# EAGLE design ClassicMouse Mark1 rev1 (EAGLE 9.6.2)
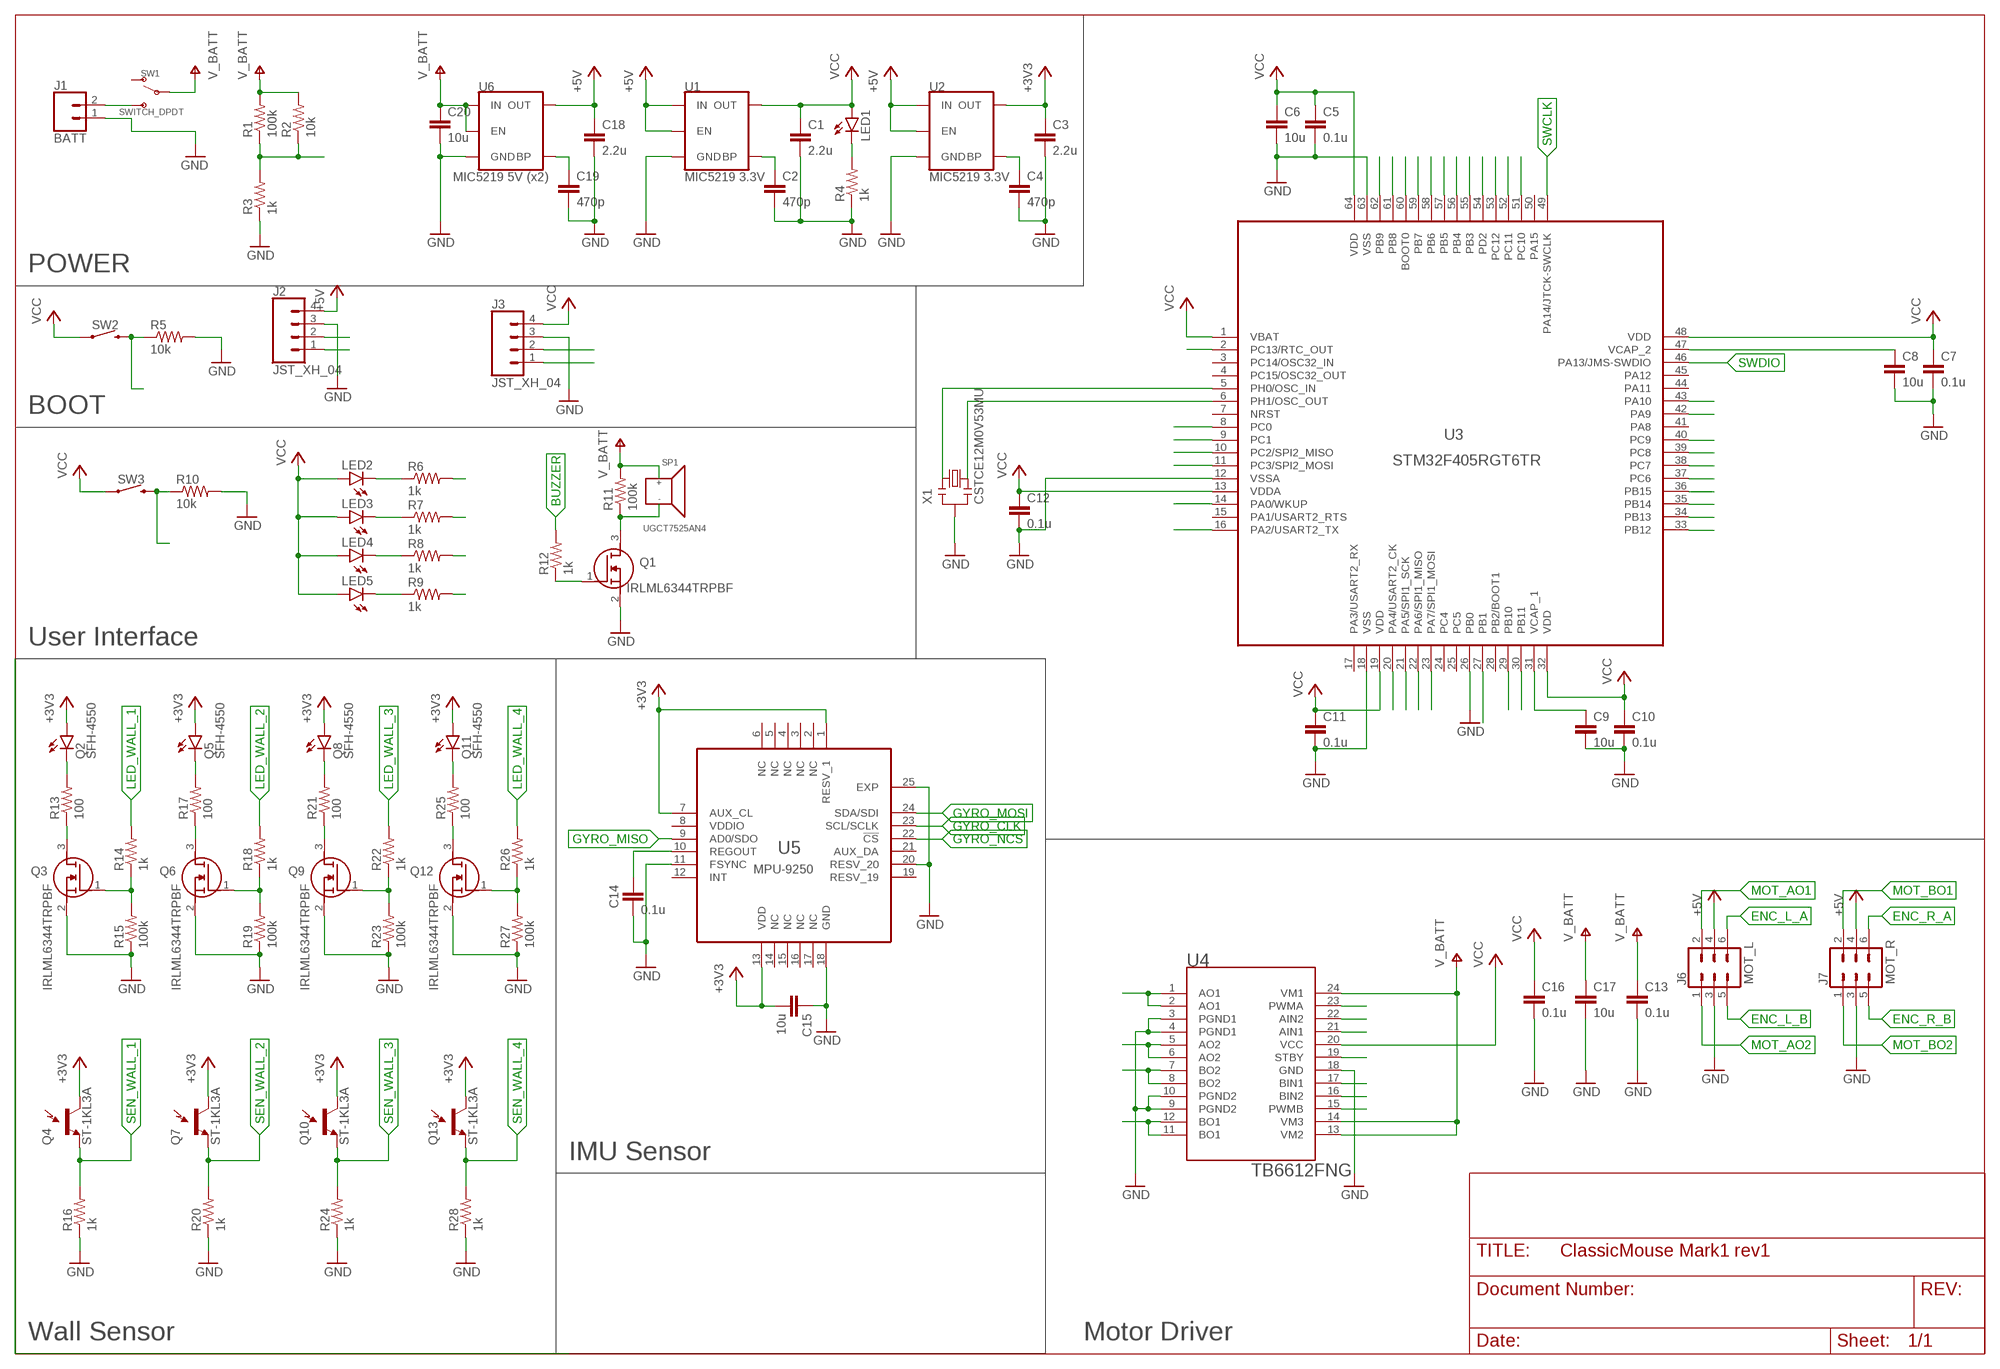
[diagram p0: schematic, sheet 1]

## Parts
C1  2.2u  C-EUC0603K  [C0603K]
C2  470p  C-EUC0603K  [C0603K]
C3  2.2u  C-EUC0603K  [C0603K]
C4  470p  C-EUC0603K  [C0603K]
C5  0.1u  C-EUC0603K  [C0603K]
C6  10u  C-EUC0603K  [C0603K]
C7  0.1u  C-EUC0603K  [C0603K]
C8  10u  C-EUC0603K  [C0603K]
C9  10u  C-EUC0603K  [C0603K]
C10  0.1u  C-EUC0603K  [C0603K]
C11  0.1u  C-EUC0603K  [C0603K]
C12  0.1u  C-EUC0603K  [C0603K]
C13  0.1u  C-EUC0603K  [C0603K]
C14  0.1u  C-EUC0603K  [C0603K]
C15  10u  C-EUC1206  [C1206]
C16  0.1u  C-EUC0603K  [C0603K]
C17  10u  C-EUC1206  [C1206]
C18  2.2u  C-EUC0603K  [C0603K]
C19  470p  C-EUC0603K  [C0603K]
C20  10u  C-EUC1206  [C1206]
J1  BATT  JST_XH_02  [JST-XH-02-PACKAGE-ROUND-PAD]
J2  JST_XH_04  [JST-XH-04-PACKAGE-ROUND-PAD]
J3  JST_XH_04  [JST-XH-04-PACKAGE-ROUND-PAD]
J6  MOT_L  2X3_PIN  [2X3-NS]
J7  MOT_R  2X3_PIN  [2X3-NS]
LED1  LEDCHIPLED_0603  [CHIPLED_0603]
LED2  LEDCHIPLED_0603  [CHIPLED_0603]
LED3  LEDCHIPLED_0603  [CHIPLED_0603]
LED4  LEDCHIPLED_0603  [CHIPLED_0603]
LED5  LEDCHIPLED_0603  [CHIPLED_0603]
Q1  IRLML6344TRPBF  [SOT95P260X110-3N]
Q2  SFH-4550  YZ000  [CONN_02]
Q3  IRLML6344TRPBF  [SOT95P260X110-3N]
Q4  ST-1KL3A  [CONN_02]
Q5  SFH-4550  YZ000  [CONN_02]
Q6  IRLML6344TRPBF  [SOT95P260X110-3N]
Q7  ST-1KL3A  [CONN_02]
Q8  SFH-4550  YZ000  [CONN_02]
Q9  IRLML6344TRPBF  [SOT95P260X110-3N]
Q10  ST-1KL3A  [CONN_02]
Q11  SFH-4550  YZ000  [CONN_02]
Q12  IRLML6344TRPBF  [SOT95P260X110-3N]
Q13  ST-1KL3A  [CONN_02]
R1  100k  R-US_R0603  [R0603]
R2  10k  R-US_R0603  [R0603]
R3  1k  R-US_R0603  [R0603]
R4  1k  R-US_R0603  [R0603]
R5  10k  R-US_R0603  [R0603]
R6  1k  R-US_R0603  [R0603]
R7  1k  R-US_R0603  [R0603]
R8  1k  R-US_R0603  [R0603]
R9  1k  R-US_R0603  [R0603]
R10  10k  R-US_R0603  [R0603]
R11  100k  R-US_R0603  [R0603]
R12  1k  R-US_R0603  [R0603]
R13  100  R-US_R0603  [R0603]
R14  1k  R-US_R0603  [R0603]
R15  100k  R-US_R0603  [R0603]
R16  1k  R-US_R0603  [R0603]
R17  100  R-US_R0603  [R0603]
R18  1k  R-US_R0603  [R0603]
R19  100k  R-US_R0603  [R0603]
R20  1k  R-US_R0603  [R0603]
R21  100  R-US_R0603  [R0603]
R22  1k  R-US_R0603  [R0603]
R23  100k  R-US_R0603  [R0603]
R24  1k  R-US_R0603  [R0603]
R25  100  R-US_R0603  [R0603]
R26  1k  R-US_R0603  [R0603]
R27  100k  R-US_R0603  [R0603]
R28  1k  R-US_R0603  [R0603]
SP1  UGCT7525AN4  [UGCT7525AN4]
SW1  SWITCH_DPDT  [SWITCH_DPDT]
SW2  MOMENTARY-SWITCH-SPST-SMD-4.6X2.8MM  [TACTILE_SWITCH_SMD_4.6X2.8MM]
SW3  MOMENTARY-SWITCH-SPST-SMD-4.6X2.8MM  [TACTILE_SWITCH_SMD_4.6X2.8MM]
U1  MIC5219 3.3V  V_REG_MIC52193.3V  [SOT23-5]
U2  MIC5219 3.3V  V_REG_MIC52193.3V  [SOT23-5]
U3  STM32F405RGT6TR  [QFP50P1200X1200X160-64N]
U4  TB6612FNG  [SOP65P760X160-24N]
U5  MPU-9250  [QFN40P300X300X105-25N]
U6  MIC5219 5V (x2)  V_REG_MIC52193.3V  [SOT23-5]
X1  CSTCE12M0V53MU  [CSTCE12M0V53]

## Nets
+3V3: C3.1 C15.2 Q2.+(A) Q4.+(C1) Q5.+(A) Q7.+(C1) Q8.+(A) Q10.+(C1) Q11.+(A) Q13.+(C1) U2.5(OUT) U5.1(RESV_1) U5.7(AUX_CL) U5.13(VDD)
+5V: C18.1 J2.4 J6.4 J7.4 U1.1(IN) U1.3(EN) U2.1(IN) U2.3(EN) U6.5(OUT)
BATT_V: R1.1 R2.1 R3.2 U3.27(PB1)
BOOT0/SWITCH1: R5.1 SW2.3 SW2.4 U3.2(PC13/RTC_OUT) U3.60(BOOT0)
BUZZER: R12.2 U3.62(PB9)
ENC_L_A: J6.6 U3.56(PB4)
ENC_L_B: J6.5 U3.57(PB5)
ENC_R_A: J7.6 U3.58(PB6)
ENC_R_B: J7.5 U3.59(PB7)
GND: C1.2 C2.2 C3.2 C4.2 C5.2 C6.2 C7.2 C8.2 C9.2 C10.2 C11.2 C12.2 C13.2 C14.2 C15.1 C16.2 C17.2 C18.2 C19.2 C20.2 J1.1 J2.3 J3.3 J6.3 J7.3 Q1.2(S) Q3.2(S) Q6.2(S) Q9.2(S) Q12.2(S) R3.1 R4.1 R5.2 R10.2 R15.1 R16.1 R19.1 R20.1 R23.1 R24.1 R27.1 R28.1 U1.2(GND) U2.2(GND) U3.12(VSSA) U3.18(VSS) U3.26(PB0) U3.63(VSS) U4.3(PGND1) U4.4(PGND1) U4.9(PGND2) U4.10(PGND2) U4.18(GND) U5.11(FSYNC) U5.18(GND) U5.20(RESV_20) U5.25(EXP) U6.2(GND) X1.2
GYRO_CLK: U3.21(PA5/SPI1_SCK) U5.23(SCL/SCLK)
GYRO_MISO: U3.22(PA6/SPI1_MISO) U5.9(AD0/SDO)
GYRO_MOSI: U3.23(PA7/SPI1_MOSI) U5.24(SDA/SDI)
GYRO_NCS: U3.20(PA4/USART2_CK) U5.22(!CS)
LCD_SCL: U3.29(PB10)
LCD_SDA: U3.30(PB11)
LED1: R6.2 U3.40(PC9)
LED2: R7.2 U3.39(PC8)
LED3: R8.2 U3.38(PC7)
LED4: R9.2 U3.37(PC6)
LED_WALL_1: R14.2 U3.36(PB15)
LED_WALL_2: R18.2 U3.35(PB14)
LED_WALL_3: R22.2 U3.34(PB13)
LED_WALL_4: R26.2 U3.33(PB12)
MD_AIN1: U3.52(PC11) U4.21(AIN1)
MD_AIN2: U3.51(PC10) U4.22(AIN2)
MD_BIN1: U3.54(PD2) U4.17(BIN1)
MD_BIN2: U3.55(PB3) U4.16(BIN2)
MD_PWMA: U3.14(PA0/WKUP) U4.23(PWMA)
MD_PWMB: U3.16(PA2/USART2_TX) U4.15(PWMB)
MD_STBY: U3.53(PC12) U4.19(STBY)
MOT_AO1: J6.2 U4.1(AO1) U4.2(AO1)
MOT_AO2: J6.1 U4.5(AO2) U4.6(AO2)
MOT_BO1: J7.2 U4.11(BO1) U4.12(BO1)
MOT_BO2: J7.1 U4.7(BO2) U4.8(BO2)
N$1: J1.2 SW1.3(S) SW1.6(S)
N$2: C2.1 U1.4(BP)
N$3: U3.6(PH1/OSC_OUT) X1.3
N$4: C4.1 U2.4(BP)
N$5: U3.5(PH0/OSC_IN) X1.1
N$6: C8.1 U3.47(VCAP_2)
N$7: C9.1 U3.31(VCAP_1)
N$8: LED1.C R4.2
N$9: Q1.3(D) R11.1 SP1.2(GND)
N$10: Q1.1(G) R12.1
N$11: Q2.-(C) R13.2
N$12: Q3.3(D) R13.1
N$13: Q5.-(C) R17.2
N$14: Q3.1(G) R14.1 R15.2
N$15: Q6.3(D) R17.1
N$16: Q6.1(G) R18.1 R19.2
N$17: Q8.-(C) R21.2
N$18: Q9.3(D) R21.1
N$19: Q9.1(G) R22.1 R23.2
N$20: Q11.-(C) R25.2
N$21: Q12.3(D) R25.1
N$22: Q12.1(G) R26.1 R27.2
N$24: LED2.C R6.1
N$25: LED3.C R7.1
N$26: C14.1 U5.10(REGOUT)
N$27: C19.1 U6.4(BP)
N$28: LED4.C R8.1
N$29: LED5.C R9.1
SEN_WALL_1: Q4.-(E1) R16.2 U3.8(PC0)
SEN_WALL_2: Q7.-(E1) R20.2 U3.9(PC1)
SEN_WALL_3: Q10.-(E1) R24.2 U3.10(PC2/SPI2_MISO)
SEN_WALL_4: Q13.-(E1) R28.2 U3.11(PC3/SPI2_MOSI)
SWCLK: J3.1 U3.49(PA14/JTCK-SWCLK)
SWDIO: J3.2 U3.46(PA13/JMS-SWDIO)
SWITCH2: R10.1 SW3.3 SW3.4 U3.61(PB8)
USART_RX: J2.1 U3.43(PA10)
USART_TX: J2.2 U3.42(PA9)
V+: C13.1 C17.1 C20.1 R1.2 R2.2 R11.2 SP1.1(V) SW1.2(P) SW1.5(P) U4.13(VM2) U4.14(VM3) U4.24(VM1) U6.1(IN) U6.3(EN) ; supply symbol labelled V_BATT
VCC: C1.1 C5.1 C6.1 C7.1 C10.1 C11.1 C12.1 C16.1 J3.4 LED1.A LED2.A LED3.A LED4.A LED5.A SW2.1 SW2.2 SW3.1 SW3.2 U1.5(OUT) U3.1(VBAT) U3.13(VDDA) U3.19(VDD) U3.32(VDD) U3.48(VDD) U3.64(VDD) U4.20(VCC)
Unconnected: SW1.1(O) SW1.4(O) U3.3(PC14/OSC32_IN) U3.4(PC15/OSC32_OUT) U3.7(NRST) U3.15(PA1/USART2_RTS) U3.17(PA3/USART2_RX) U3.24(PC4) U3.25(PC5) U3.28(PB2/BOOT1) U3.41(PA8) U3.44(PA11) U3.45(PA12) U3.50(PA15) U5.2(NC) U5.3(NC) U5.4(NC) U5.5(NC) U5.6(NC) U5.12(INT) U5.14(NC) U5.15(NC) U5.16(NC) U5.17(NC) U5.19(RESV_19) U5.21(AUX_DA)

## Notes on the sheet
- POWER
- BOOT
- User Interface
- IMU Sensor
- Wall Sensor | Motor Driver

## Power pins joined to a net without a drawn wire
VDDIO: U5.8(VDDIO)

## Library data of the parts
C1-C20 = rcl:C-EU: CAPACITOR, European symbol; SPICEPREFIX: C
J1 = MM_CONN:JST_XH_02
J2 J3 = MM_CONN:JST_XH_04
J6 J7 = MM_CONN:2X3_PIN
LED1-LED5 = led:LED: LED OSRAM: - CHIPLED LG R971, LG N971, LY N971, LG Q971, LY Q971, LO R971, LY R971 LH N974, LH R974 LS Q976, LO Q976, LY Q976 LO Q996 - Hyper CHIPLED LW Q18S LB Q993, LB Q99A, LB R99A - SideLED LS A670, LO A670, LY A670, LG A670, LP A670 LB A673, LV A673, LT A673, LW A673 LH A674 LY A675 LS A676, LA A676, LO A676, LY A676, LW A676 LS A679, LY A679, LG A679 - Hyper Micro SIDELED® LS Y876, LA Y876, LO Y876, LY Y876 LT Y87S - SmartLED LW L88C, LW L88S LB L89C, LB L89S, LG L890 LS L89K, LO L89K, LY L89K LS L896, LA L896, LO L896, LY L896 - TOPLED LS T670, LO T670, LY T670, LG T670, LP T670 LSG T670, LSP T670, LSY T670, LOP T670, LYG T670 LG T671, LOG T671, LSG T671 LB T673, LV T673, LT T673, LW T673 LH T674 LS T676, LA T676, LO T676, LY T676, LB T676, LH T676, LSB T676, LW T676 LB T67C, LV T67C, LT T67C, LS T67K, LO T67K, LY T67K, LW E67C LS E67B, LA E67B, LO E67B, LY E67B, LB E67C, LV E67C, LT E67C LW T67C LS T679, LY T679, LG T679 LS T770, LO T770, LY T770, LG T770, LP T770 LB T773, LV T773, LT T773, LW T773 LH T774 LS E675, LA E675, LY E675, LS T675 LS T776, LA T776, LO T776, LY T776, LB T776 LHGB T686 LT T68C, LB T68C - Hyper Mini TOPLED® LB M676 - Mini TOPLED Santana® LG M470 LS M47K, LO M47K, LY M47K Source: http://www.osram.convergy.de LUXEON: - LUMILED® LXK2-PW12-R00, LXK2-PW12-S00, LXK2-PW14-U00, LXK2-PW14-V00 LXK2-PM12-R00, LXK2-PM12-S00, LXK2-PM14-U00 LXK2-PE12-Q00, LXK2-PE12-R00, LXK2-PE12-S00, LXK2-PE14-T00, LXK2-PE14-U00 LXK2-PB12-K00, LXK2-PB12-L00, LXK2-PB12-M00, LXK2-PB14-N00, LXK2-PB14-P00, LXK2-PB14-Q00 LXK2-PR12-L00, LXK2-PR12-M00, LXK2-PR14-Q00, LXK2-PR14-R00 LXK2-PD12-Q00, LXK2-PD12-R00, LXK2-PD12-S00 LXK2-PH12-R00, LXK2-PH12-S00 LXK2-PL12-P00, LXK2-PL12-Q00, LXK2-PL12-R00 Source: www.luxeon.com KINGBRIGHT: KA-3528ASYC Source: www.kingbright.com
Q1 Q3 Q6 Q9 Q12 = IRLML6344TRPBF:IRLML6344TRPBF: International Rectifier IRLML6344TRPBF N-channel MOSFET Transistor, 5 A, 30 V, 3-Pin SOT-23 Source: Datasheet <http://docs-emea.rs-online.com/webdocs/0f87/0900766b80f8731b.pdf>; DESCRIPTION: International Rectifier IRLML6344TRPBF N-channel MOSFET Transistor, 5 A, 30 V, 3-Pin SOT-23; HEIGHT: 1.1mm; MANUFACTURER_NAME: Infineon; MANUFACTURER_PART_NUMBER: IRLML6344TRPBF; MOUSER_PART_NUMBER: 942-IRLML6344TRPBF; MOUSER_PRICE-STOCK: https://www.mouser.com/Search/Refine.aspx?Keyword=942-IRLML6344TRPBF; RS_PART_NUMBER: 9134073; RS_PRICE-STOCK: http://uk.rs-online.com/web/p/products/9134073
Q2 Q5 Q8 Q11 = MM_SENSOR:YZ000
Q4 Q7 Q10 Q13 = MM_SENSOR:ST-1KL3A
R1-R28 = rcl:R-US_: RESISTOR, American symbol; SPICEPREFIX: R
SP1 = UGCT7525AN4:UGCT7525AN4
SW1 = MM_SWITCH:SWITCH_DPDT
SW2 SW3 = MM_SWITCH:MOMENTARY-SWITCH-SPST: Momentary Switch (Pushbutton) - SPST Normally-open (NO) SPST momentary switches (buttons, pushbuttons). Variants PTH-12MM - 12mm square, through-hole Momentary Pushbutton Switch - 12mm Square <https://www.sparkfun.com/products/9190> (COM-09190) PTH-6.0MM, PTH-6.0MM-KIT - 6.0mm square, through-hole Mini Pushbutton Switch <https://www.sparkfun.com/products/97> (COM-00097) KIT package intended for soldering kit's - only one side of pads' copper is exposed. PTH-RIGHT-ANGLE-KIT - Right-angle, through-hole Right Angle Tactile Button <https://www.sparkfun.com/products/10791> - Used on SparkFun BigTime Watch Kit <https://www.sparkfun.com/products/11734> SMD-12MM - 12mm square, surface-mount Tactile Button - SMD (12mm) <https://www.sparkfun.com/products/12993> (COM-12993) Used on SparkFun PicoBoard <https://www.sparkfun.com/products/11888> SMD-4.5MM - 4.5mm Square Trackball Switch Used on SparkFun Blackberry Trackballer Breakout <https://www.sparkfun.com/products/13169> SMD-4.6MMX2.8MM - 4.60mm x 2.80mm, surface mount Used on SparkFun Pro Micro - RP2040 <https://www.sparkfun.com/products/17717> SMD-5.2MM, SMD-5.2-REDUNDANT - 5.2mm square, surface-mount Mini Pushbutton Switch - SMD <https://www.sparkfun.com/products/8720> (COM-08720) Used on Arduino Pro Mini <https://www.sparkfun.com/products/11114> REDUNDANT package connects both switch circuits together SMD-6.0X3.5MM - 6.0 x 3.5mm, surface mount Momentary Reset Switch SMD <https://www.sparkfun.com/products/8229> (COM-08229) SMD-6.2MM-TALL - 6.2mm square, surface mount Tactile Button - SMD (6mm) <https://www.sparkfun.com/products/12992> Used on SparkFun Digital Sandbox <https://www.sparkfun.com/products/12651> SMD-RIGHT-ANGLE - Right-angle, surface mount Used on SparkFun Block for Intel® Edison - Arduino <https://www.sparkfun.com/products/13036>; PROD_ID: SWCH-15606
U1 U2 = MM_POWER:V_REG_MIC5219: V_REG MIC5219 Standard 3.3V and 5V 500mA LDO voltage regulator in SOT-23 layout. Micrel part MIC5219. BP (by-pass) pin is used to lower output noise with 470pF cap, may be left open.; PROD_ID: VREG-09872
U3 = STM32F405RGT6TR:STM32F405RGT6TR: High-performance foundation line, ARM Cortex-M4 core with DSP and FPU, 1 Mbyte Flash, 168 MHz CPU, ART Accelerator Check availability <https://pricing.snapeda.com/parts/STM32F405RGT6TR/STMicroelectronics/view-part?ref=eda>; AVAILABILITY: In Stock; DESCRIPTION: ARM® Cortex®-M4 STM32F4 Microcontroller IC 32-Bit Single-Core 168MHz 1MB (1M x 8) FLASH 64-LQFP (10x10); MF: STMicroelectronics; MP: STM32F405RGT6TR; PACKAGE: LQFP-64 STMicroelectronics; PRICE: None; PURCHASE-URL: https://pricing.snapeda.com/search/part/STM32F405RGT6TR/?ref=eda
U4 = TB6612FNG:TB6612FNG: Stepping Motor Driver Ic Unipolor Copper Wire 8"; AVAILABILITY: Unavailable; DESCRIPTION: Stepping Motor Driver Ic Unipolor Copper Wire 8; MF: Toshiba; MP: TB6612FNG,C,8,EL; PACKAGE: SSOP-24 Toshiba; PRICE: None
U5 = MPU-9250:MPU-9250: Check availability <https://pricing.snapeda.com/parts/MPU-9250/TDK%20InvenSense/view-part?ref=eda>; AVAILABILITY: In Stock; DESCRIPTION: Accelerometer, Gyroscope, Magnetometer, 9 Axis Sensor I²C, SPI Output; MF: TDK InvenSense; MP: MPU-9250; PACKAGE: TFQFN-24 TDK InvenSense; PRICE: None; PURCHASE-URL: https://pricing.snapeda.com/search/part/MPU-9250/?ref=eda
U6 = MM_POWER:V_REG_MIC5219: V_REG MIC5219 Standard 3.3V and 5V 500mA LDO voltage regulator in SOT-23 layout. Micrel part MIC5219. BP (by-pass) pin is used to lower output noise with 470pF cap, may be left open.; PROD_ID: VREG-09872; VALUE: MIC5219 3.3V
X1 = CSTCE12M:CSTCE12M0V53: CSTCE16M0V53 Ceramic Resonator (CERALOCK) 16 MHz Chip Type; AVAILABILITY: Unavailable; DESCRIPTION: CERALOCK 16.000MHz +/-5% 15pF; MF: Murata; MP: CSTCE16M0V53; PACKAGE: None; PRICE: None

## Board
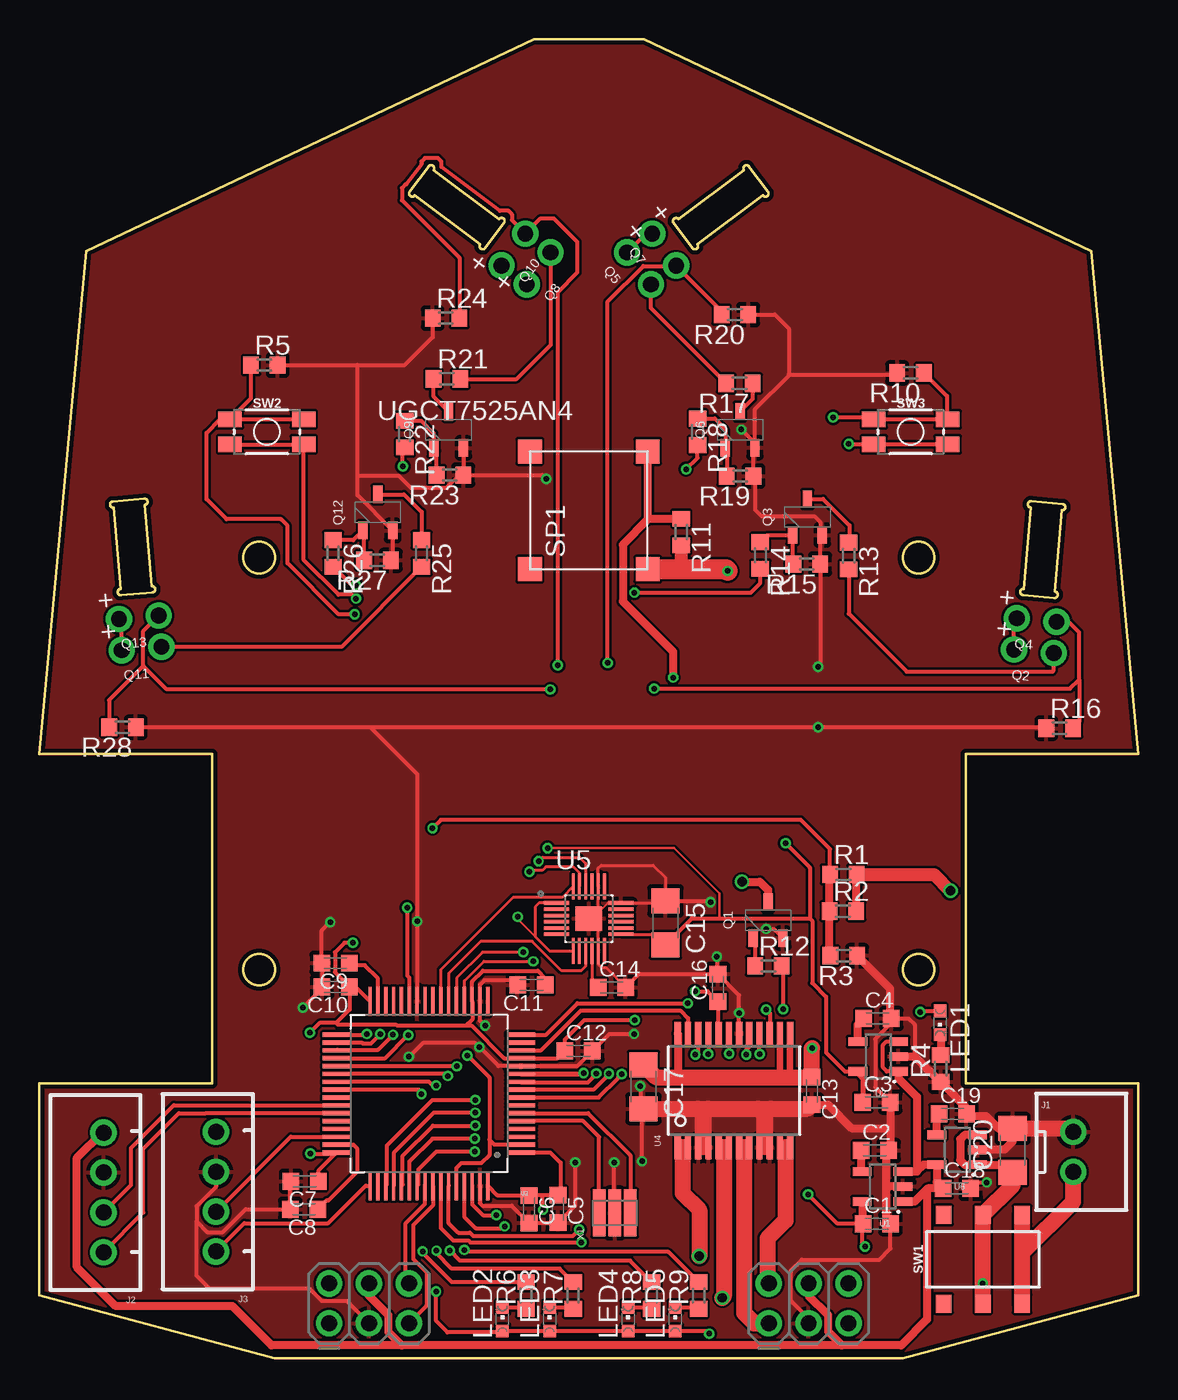
[diagram p1: board, top side]
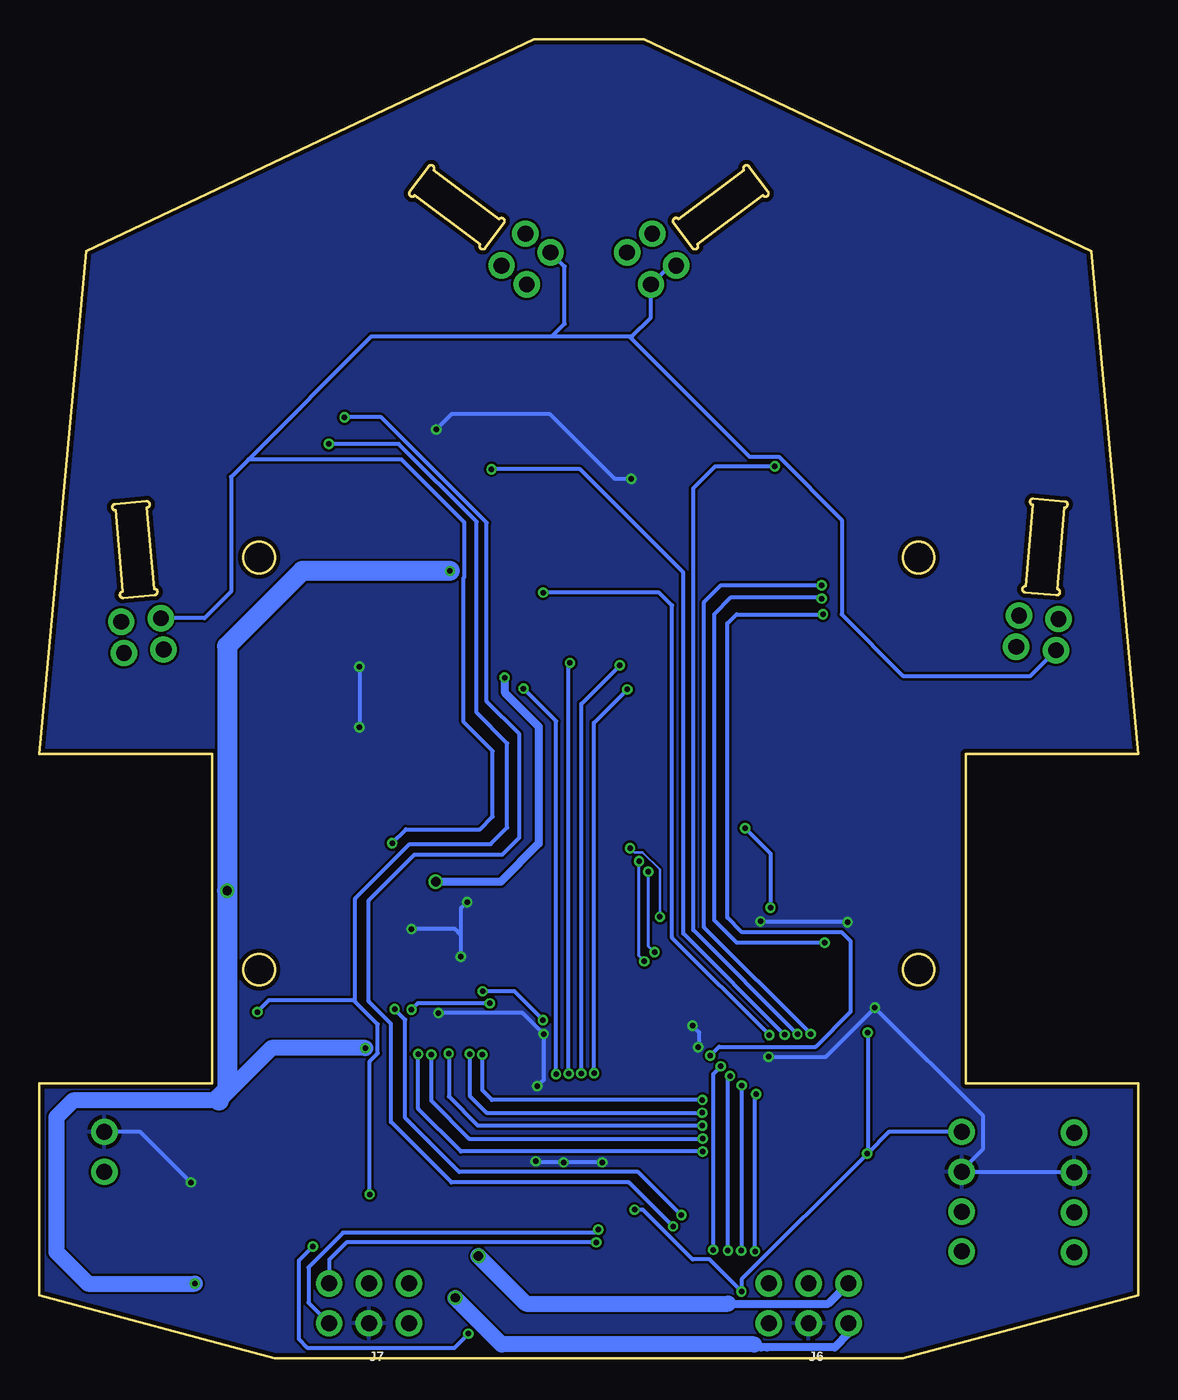
[diagram p2: board, bottom side, seen from below]

Size 70 x 84 mm. Coordinates in mm from the lower left corner, seen from the top.
Outline: 59,38.5 70,38.5 67,70.5 38.5,84 31.5,84 3,70.5 0,38.5 11,38.5 11,17.5 0,17.5 0,4 15,0 55,0 70,4 70,17.5 59,17.5 59,38.5
Outline: 62.66,48.6 64.65,48.43 arc180 64.68,48.83 65.14,54.01 arc180 65.17,54.41 63.18,54.58 arc180 63.14,54.18 62.69,49 arc180 62.66,48.6
Outline: 40.4,72.3 41.6,70.7 arc180 41.92,70.94 46.08,74.06 arc180 46.4,74.3 45.2,75.9 arc180 44.88,75.66 40.72,72.54 arc180 40.4,72.3
Outline: 28.4,70.7 29.6,72.31 arc180 29.28,72.55 25.12,75.66 arc180 24.8,75.9 23.6,74.3 arc180 23.92,74.06 28.08,70.94 arc180 28.4,70.7
Outline: 5.21,48.6 7.21,48.77 arc180 7.17,49.17 6.72,54.35 arc180 6.68,54.75 4.69,54.57 arc180 4.73,54.17 5.18,49 arc180 5.21,48.6
Outline: circle at 14,24.75 radius 1
Outline: circle at 56,24.75 radius 1
Outline: circle at 56,51 radius 1
Outline: circle at 14,51 radius 1
Copper layers (1*16): Top 0.035mm / dielectric 1.5mm / Bottom 0.035mm
Design rules "Elecrow_2-layer_eagle_rule": minimum track width 6mil, minimum drill 12mil, track to track 6mil, track to pad 6mil, pad to pad 6mil, via to via 6mil, smd to smd 0mil, copper to edge 10mil, drill to drill 10mil, minimum pad ring 10mil, minimum via ring 6mil, stop-mask expansion 2mil, vias tented up to drill 100mil, thermal gap 10mil

### Footprints (pad centres in the part's own frame; a part is rotated, then mirrored left to right if it is on the bottom)
C0603K = smd 1.05 x 1.08: 1 -0.875,0; 2 0.875,0
C1206 = smd 1.6 x 1.8: 1 -1.4,0; 2 1.4,0
JST-XH-02-PACKAGE-ROUND-PAD = drill 1.016 pad 1.676: 1 -1.27,0; 2 1.27,0
JST-XH-04-PACKAGE-ROUND-PAD = drill 1.016 pad 1.676: 1 -3.81,0; 2 -1.27,0; 3 1.27,0; 4 3.81,0
2X3-NS = drill 1.016 pad 1.676: 1 -2.54,1.27; 2 -2.54,-1.27; 3 0,1.27; 4 0,-1.27; 5 2.54,1.27; 6 2.54,-1.27
CHIPLED_0603 = smd 0.8 x 0.8: A 0,-0.75; C 0,0.75
SOT95P260X110-3N = smd 1.1 x 0.6: 1 -1.15,0.95; 2 -1.15,-0.95; 3 1.15,0
CONN_02 = drill 1 pad 1.676: + -1.27,0; - 1.27,0
R0603 = smd 1 x 1.1: 1 -0.85,0; 2 0.85,0
UGCT7525AN4 = smd 1.524 x 1.524: 1 -3.75,3.75; 2 -3.75,-3.75; 3 3.75,3.75; 4 3.75,-3.75
SWITCH_DPDT = smd 1 x 1.15: 1 -2.5,2.825; 2 0,2.825; 3 2.5,2.825; 4 -2.5,-2.825; 5 0,-2.825; 6 2.5,-2.825
TACTILE_SWITCH_SMD_4.6X2.8MM = smd 1.5 x 1: 1 -2.35,-0.8; 2 2.35,-0.8; 3 2.35,0.8; 4 -2.35,0.8
SOT23-5 = smd 0.55 x 1.2: 1 -0.95,-1.3; 2 0,-1.3; 3 0.95,-1.3; 4 0.95,1.3; 5 -0.95,1.3
QFP50P1200X1200X160-64N = smd 1.87 x 0.28: 1 -5.87,3.75; 2 -5.87,3.25; 3 -5.87,2.75; 4 -5.87,2.25; 5 -5.87,1.75; 6 -5.87,1.25; 7 -5.87,0.75; 8 -5.87,0.25; 9 -5.87,-0.25; 10 -5.87,-0.75; 11 -5.87,-1.25; 12 -5.87,-1.75; 13 -5.87,-2.25; 14 -5.87,-2.75; 15 -5.87,-3.25; 16 -5.87,-3.75; 33 5.87,-3.75; 34 5.87,-3.25; 35 5.87,-2.75; 36 5.87,-2.25; 37 5.87,-1.75; 38 5.87,-1.25; 39 5.87,-0.75; 40 5.87,-0.25; 41 5.87,0.25; 42 5.87,0.75; 43 5.87,1.25; 44 5.87,1.75; 45 5.87,2.25; 46 5.87,2.75; 47 5.87,3.25; 48 5.87,3.75 | smd 0.28 x 1.87: 17 -3.75,-5.87; 18 -3.25,-5.87; 19 -2.75,-5.87; 20 -2.25,-5.87; 21 -1.75,-5.87; 22 -1.25,-5.87; 23 -0.75,-5.87; 24 -0.25,-5.87; 25 0.25,-5.87; 26 0.75,-5.87; 27 1.25,-5.87; 28 1.75,-5.87; 29 2.25,-5.87; 30 2.75,-5.87; 31 3.25,-5.87; 32 3.75,-5.87; 49 3.75,5.87; 50 3.25,5.87; 51 2.75,5.87; 52 2.25,5.87; 53 1.75,5.87; 54 1.25,5.87; 55 0.75,5.87; 56 0.25,5.87; 57 -0.25,5.87; 58 -0.75,5.87; 59 -1.25,5.87; 60 -1.75,5.87; 61 -2.25,5.87; 62 -2.75,5.87; 63 -3.25,5.87; 64 -3.75,5.87
SOP65P760X160-24N = smd 1.5 x 0.4: 1 -3.625,3.575; 2 -3.625,2.925; 3 -3.625,2.275; 4 -3.625,1.625; 5 -3.625,0.975; 6 -3.625,0.325; 7 -3.625,-0.325; 8 -3.625,-0.975; 9 -3.625,-1.625; 10 -3.625,-2.275; 11 -3.625,-2.925; 12 -3.625,-3.575; 13 3.625,-3.575; 14 3.625,-2.925; 15 3.625,-2.275; 16 3.625,-1.625; 17 3.625,-0.975; 18 3.625,-0.325; 19 3.625,0.325; 20 3.625,0.975; 21 3.625,1.625; 22 3.625,2.275; 23 3.625,2.925; 24 3.625,3.575
QFN40P300X300X105-25N = smd 1.64 x 0.22: 1 -2.045,1; 2 -2.045,0.6; 3 -2.045,0.2; 4 -2.045,-0.2; 5 -2.045,-0.6; 6 -2.045,-1; 13 2.045,-1; 14 2.045,-0.6; 15 2.045,-0.2; 16 2.045,0.2; 17 2.045,0.6; 18 2.045,1 | smd 0.22 x 1.64: 7 -1,-2.045; 8 -0.6,-2.045; 9 -0.2,-2.045; 10 0.2,-2.045; 11 0.6,-2.045; 12 1,-2.045; 19 1,2.045; 20 0.6,2.045; 21 0.2,2.045; 22 -0.2,2.045; 23 -0.6,2.045; 24 -1,2.045 | smd 1.7 x 1.54: 25 0,0
CSTCE12M0V53 = smd 0.8 x 3: 1 0.45,1.688; 2 1.45,1.688; 3 2.45,1.688

### Placement (x,y rotation side)
C1  53.34,8.57 0 top
C2  53.22,13.24 0 top
C3  53.32,16.3 0 top
C4  53.39,21.65 0 top
C5  33.02,9.51 270 top
C6  31.18,9.5 270 top
C7  16.9,11.28 180 top
C8  16.86,9.5 180 top
C9  18.86,25.16 180 top
C10  18.87,23.66 180 top
C11  31.35,23.78 180 top
C12  34.35,19.57 0 top
C13  49.2,17.02 270 top
C14  36.46,23.63 0 top
C15  39.88,27.73 270 top
C16  43.21,23.6 90 top
C17  38.48,17.29 270 top
C18  58.44,10.82 0 top
C19  58.17,15.57 0 top
C20  61.99,13.24 90 top
J1  65.85,13.15 270 top
J2  4.09,10.56 90 top
J3  11.25,10.61 90 top
J6  21,3.5 180 bottom
J7  49,3.5 180 bottom
LED1  57.36,21.37 180 top
LED2  29.5,2.5 0 top
LED3  32.5,2.5 0 top
LED4  37.5,2.5 0 top
LED5  40.5,2.5 0 top
Q1  46.41,27.91 90 top
Q2  63.35,45.03 355 top
Q3  48.92,53.57 90 top
Q4  63.52,47.02 355 top
Q5  38.2,69.41 306.8 top
Q6  44.63,59.14 90 top
Q7  39.8,70.61 306.8 top
Q8  31.8,69.41 53.2 top
Q9  26.07,59.13 90 top
Q10  30.2,70.61 53.2 top
Q11  6.52,45.2 5 top
Q12  21.56,53.87 90 top
Q13  6.34,47.19 5 top
R1  51.21,30.81 0 top
R2  51.18,28.47 0 top
R3  51.24,25.64 180 top
R4  57.41,18.45 90 top
R5  14.34,63.25 0 top
R6  31,4 90 top
R7  34,4 90 top
R8  39,4 90 top
R9  42,4 90 top
R10  55.49,62.75 180 top
R11  40.88,52.62 270 top
R12  46.44,24.99 0 top
R13  51.55,51.1 270 top
R14  45.92,51.13 270 top
R15  48.89,50.58 180 top
R16  64.99,40.12 0 top
R17  44.59,62.09 180 top
R18  41.93,59 270 top
R19  44.63,56.18 180 top
R20  44.3,66.47 180 top
R21  25.97,62.37 0 top
R22  23.28,58.85 270 top
R23  26.16,56.25 180 top
R24  25.91,66.24 0 top
R25  24.35,51.26 270 top
R26  18.72,51.26 270 top
R27  21.54,50.82 180 top
R28  5.3,40.19 180 top
SP1  35,54 180 top
SW1  60.09,6.3 0 top
SW2  14.5,59 0 top
SW3  55.5,59 0 top
U1  53.71,10.94 90 top
U2  53.43,19.22 90 top
U3  24.82,16.86 180 top
U4  44.24,17.06 90 top
U5  35,28 0 top
U6  58.46,13.28 90 top
X1  35.2,7.57 0 top

### Tracks (layer width: path | path; a pad name or v marks a point on that pad's centre or on a via)
+3V3  (via drill 0.35)
  Top 0.152: 31.58,26.86 30.47,27.97 v30.47,28.11 | v32.37,32.49 40.42,32.49 43.31,29.61 43.31,28.02
  Top 0.2: U5.1 31.84,29 31.58,28.74 31.58,26.86 32.49,25.95 U5.7 | U5.13 39.21,27
  Top 0.254: 39.21,27 C15.2 41.57,28.02 43.31,28.02 49.08,28.02 | Q11.+ 5.25,46.91 Q13.+ | Q5.+ 38.63,71.62 Q7.+ | Q2.+ 62.08,46.96 Q4.+ | U2.5 51.31,18.27 50.11,19.48 50.11,23.02 49.23,23.9 49.23,27.87 49.08,28.02 | v47.53,32.8 49.08,31.26 49.08,28.02
  Top 0.305: 52.45,17.95 C3.1
  Top 0.508: U2.5 52.45,17.95
  Bottom 0.152: v32.37,32.49 32.09,32.22 31.57,32.22 30.47,31.12 v30.47,28.11
  Bottom 0.254: v47.53,32.8 46.64,33.69 41.94,33.69 41.13,34.5 41.13,38.67 42.97,40.52 42.97,49.72 42.93,49.76 42.93,53.23 46.93,57.24 56.67,57.24 | Q4.+ 59.48,47.13 57.79,48.82 57.79,56.12 56.67,57.24 | 56.67,57.24 48.84,65.08 37.34,65.08 | 37.34,65.08 36.54,65.88 36.54,69.53 Q5.+ | 37.34,65.08 32.44,65.08 | 32.44,65.08 32.24,65.08 31.04,66.28 Q8.+ 29.84,69.59 Q10.+ | 32.44,65.08 24.77,57.41 22.9,57.41 18.89,53.39 18.89,47.37 14.98,43.46 6.87,43.46 Q11.+
+5V
  Top 0.254: U2.1 53.98,18.27 53.74,18.51 53.74,19.95 53.96,20.17 U2.3
  Top 0.508: U1.3 55.89,11.89 55.91,11.91 | 55.91,11.91 56.33,12.33 U6.5 57.16,11.23 C18.1 56.59,10.82 56.54,10.77 | U1.1 55.76,9.99 56.54,10.77 | U2.1 54.73,17.83 55.91,16.65 55.91,11.91 | 56.54,10.77 56.54,2.48 54.89,0.83 51.11,0.83 | 51.11,0.83 23.08,0.83 | 23.08,0.83 14.8,0.83 12.3,3.32 4.88,3.32 2.4,5.81 2.4,12.77 4,14.37 J2.4 | 23.08,0.83 22.24,1.66 22.24,2.75 21,3.99 J6.4 | 51.11,0.83 50.24,1.7 50.24,2.75 49,3.99 J7.4
BATT_V  (via drill 0.35)
  Top 0.254: R1.1 50.36,32.42 48.49,34.29 25.58,34.29 v25.05,33.76 | v23.43,28.7 23.43,24.38 23.57,24.24 U3.27
  Top 0.508: R3.2 50.33,25.7 R2.1 50.33,30.78 R1.1
  Bottom 0.254: v25.05,33.76 23.43,32.15 v23.43,28.7
BOOT0/SWITCH1  (via drill 0.35)
  Top 0.254: SW2.4 SW2.3 | SW2.4 13.48,61.13 R5.1 | SW2.4 11.52,59.8 10.65,58.93 10.65,54.71 11.92,53.44 15.39,53.44 15.81,53.02 15.81,50.64 19.07,47.38 v20.09,47.38 | U3.60 26.57,12.12 26.87,12.42 | 26.87,12.42 | 26.87,12.42 28.15,12.42 28.66,12.94 28.66,13.93 | v27.26,19.28 28.66,17.88 28.66,13.93 | U3.2 28.98,13.61 28.66,13.93
  Bottom 0.254: v27.26,19.28 26.7,19.85 20.55,19.85 18.32,22.08 18.32,26.55 18.89,27.13 25.24,27.13 26.18,28.07 26.18,46.79 25.59,47.38 v20.09,47.38
BUZZER  (via drill 0.35)
  Top 0.254: U3.62 27.57,9.8 28.25,9.11 v29.1,9.11 | R12.2 47.37,24.91 v47.37,22.23
  Bottom 0.254: v47.37,22.23 46.69,21.55 46.69,15.3 43.26,11.87 31.86,11.87 v29.1,9.11
ENC_L_A
  Top 0.254: U3.56 24.57,9.83 23.34,8.6 23.34,4.97 J6.6
ENC_L_B
  Top 0.254: J6.5 24.66,3.35 24.66,5.48 23.81,6.33 23.81,8.48 25.07,9.74 U3.57
ENC_R_A  (via drill 0.35)
  Top 0.254: U3.58 25.57,8.31 26.37,7.51 27.33,7.51 27.45,7.39 v34.53,7.39
  Bottom 0.254: J7.6 51.54,6.28 50.44,7.39 v34.53,7.39
ENC_R_B  (via drill 0.35)
  Top 0.254: U3.59 26.07,8.6 26.68,7.99 27.43,7.99 27.63,7.79 33.99,7.79 v34.39,8.19
  Bottom 0.254: v34.39,8.19 34.59,7.99 47.17,7.99 47.36,7.99 50.65,7.99 52.85,5.79 52.85,3.54 J7.5
GND  (via drill 0.35)
  Top 0.152: U5.20 35.6,28.6 35.08,28.08 | 35.08,28.08 U5.25 35.6,27.4 U5.11 | U5.18 36.21,29.01 35.29,28.08 35.08,28.08
  Top 0.2: C14.2 36.08,24.88 35.8,24.88 35.6,25.08 U5.11 | U5.18 39.75,29 | U5.20 35.6,31.2 35.8,31.4 39.09,31.4 39.88,30.61 C15.1
  Top 0.254: 39.75,29 C15.1 42.67,29.13 v42.75,29.05 | C7.2 15.98,11.24 C8.2 13.16,9.5 11.69,8.03 10.7,8.03 10.01,8.72 | C5.2 | U3.63 28.07,9.88 28.22,9.72 30.09,9.72 C6.2 31.19,8.63 C5.2 | C11.2 30.18,24.07 28.35,24.07 28.07,23.79 U3.18 28.07,21.51 v28.4,21.18 | U4.18 v44.57,22 44.57,23.11 C16.2 43.15,24.53 | R27.1 22.51,50.94 Q12.2 20.26,54.97 20.26,56.29 | Q9.2 R23.1 | Q6.2 45.48,57.89 R19.1 45.58,56.08 45.58,54.05 46.01,53.62 49.36,53.62 49.73,53.25 49.73,52.29 | 49.73,52.29 R15.1 49.73,44.17 v49.61,44.04 | 49.73,52.29 Q3.2 | C1.2 54.22,6.99 53.51,6.29 48.57,6.29 47.88,5.6 47.88,3.66 49,2.55 J7.3 | C5.2 34.14,9.75 v34.14,12.47 | X1.2 36.61,9.3 v36.61,12.47 | v16.79,22.33 18,23.54 C10.2 C9.2 17.99,27.24 v18.53,27.78 | U3.26 v24.07,27.83 24.07,37.21 21.08,40.19 | R28.1 21.08,40.19 | 21.08,40.19 v49.61,40.19 64.06,40.19 R16.1 | v43.15,25.58 43.15,24.53 | C14.2 38.19,24.48 43.11,24.48 43.15,24.53 | v37.88,20.66 36.31,20.66 C12.2 34.26,18.61 U3.12 29.24,18.61 v28.03,19.82 27.77,20.09 24.43,20.09 v23.54,19.2 | v38.39,12.55 38.39,15.8 C17.2 38.28,16.1 v38.28,17.33 | R5.2 20.26,63.25 | 20.26,63.25 23.28,63.25 25.06,65.03 R24.1 | 20.26,56.29 20.26,63.25 | R23.1 26.75,56.25 25.92,55.42 23.68,55.42 22.9,56.2 20.35,56.2 20.26,56.29 | R23.1 32.04,56.25 v32.29,56 | v44.72,59.14 45.58,58.28 Q6.2 | R20.1 46.85,66.47 47.73,65.59 47.73,62.66 47.77,62.62 | 47.77,62.62 54.5,62.62 R10.2 | Q6.2 45.58,60.43 47.77,62.62 | v46.29,27.34 46.78,27.34 Q1.2 | 10.01,8.72 10.01,9.68 11.25,10.92 J3.3 | C3.2 53.24,17.26 53.24,20.34 54.26,21.36 C4.2 55.36,21.64 55.75,21.25 55.75,19.22 | C18.2 59.7,11.2 v60.34,11.2 | 10.01,8.72 10.01,5.27 10.82,4.46 17.19,4.46 18,3.65 19.58,3.65 J6.3
  Top 0.406: 41.92,15.89 41.97,15.84 U4.3 42.28,13.44 U4.4 42.62,15.88 42.61,15.89 | 45.8,15.89 45.87,15.82 U4.9 46.23,13.44 U4.10 46.52,15.84 46.58,15.89
  Top 0.508: U6.2 59.78,13.3 61.48,13.3 61.99,13.8 C20.2 61.08,14.64 60.31,15.41 59.2,15.41 | C19.2 59.2,15.41 | U1.2 54.12,10.94 53.93,10.74 | 53.93,10.74 53.93,8.86 C1.2 | 53.93,10.74 53.93,13.07 C2.2 54.2,13.34 54.2,14.66 | C3.2 54.2,14.66 | 59.2,15.41 59.2,15.8 R4.1 56.69,18.32 56.66,18.32 55.75,19.22 U2.2 | C13.2 50.25,16.14 51.73,14.66 54.2,14.66 | R3.1 54.18,23.55 54.18,21.73 C4.2
  Top 1.016: C20.2 65.63,14.64 J1.1 | C17.2 41.92,15.89 | 41.92,15.89 42.61,15.89 45.8,15.89 | 45.8,15.89 46.58,15.89 48.95,15.89 C13.2 | 42.28,13.44 42.28,15.54 41.92,15.89 | 46.23,13.44 46.23,15.46 45.8,15.89
  Bottom 0.254: v34.14,12.47 v36.61,12.47 38.31,12.47 v38.39,12.55 | v42.75,29.05 43.15,28.64 43.15,26.97 | 43.15,26.97 v43.15,25.58 43.29,25.72 | v44.57,22 39.23,22 38.17,20.93 38.16,20.93 v37.88,20.66 37.88,17.73 v38.28,17.33 | v28.03,19.82 27.98,19.87 27.98,20.77 v28.4,21.18 | v23.54,19.2 19.92,19.2 v16.79,22.33 9.88,15.43 9.88,13.35 11.25,11.98 J3.3 11.2,11.83 J2.3 | v32.29,56 33.34,56 37.46,60.12 43.74,60.12 v44.72,59.14 | v49.61,44.04 v49.61,40.19 | 43.15,26.97 43.52,27.34 v46.29,27.34 | v18.53,27.78 24.02,27.78 v24.07,27.83 | v60.34,11.2 63.56,14.42 J1.1
  pour Top: 15,0 0,4 0,17.5 11,17.5 11,38.5 0,38.5 3,70.5 31.5,84 38.5,84 67,70.5 70,38.5 59,38.5 59,17.5 70,17.5 70,4 55,0
  pour Bottom: 0,17.5 0,4 15,0 55,0 70,4 70,17.5 59,17.5 59,38.5 70,38.5 67,70.5 38.5,84 31.5,84 3,70.5 0,38.5 11,38.5 11,17.5
GYRO_CLK  (via drill 0.35)
  Top 0.2: U5.23 34.41,30.05 34.41,30.91 34.01,31.31 32.27,31.31 32.04,31.08 31.31,31.08 v31.22,30.99 | U3.21 26.58,22.75 26.58,24.22 28.23,25.86 v30.81,25.86 v30.82,25.86
  Bottom 0.2: v31.22,30.99 31.22,26.26 v30.82,25.86
GYRO_MISO
  Top 0.2: U5.9 34.8,24.97 34.51,24.68 33.27,24.68 31.38,26.56 28.11,26.56 26.07,24.52 U3.22
GYRO_MOSI
  Top 0.2: U5.24 33.32,29.36 30.18,29.36 25.56,24.75 U3.23
GYRO_NCS  (via drill 0.35)
  Top 0.2: U3.20 27.08,24.04 28.32,25.28 v31.47,25.28 | U5.22 34.8,31.53 34.41,31.91 32.05,31.91 v31.8,31.66
  Bottom 0.2: v31.47,25.28 31.8,25.61 v31.8,31.66
LED1  (via drill 0.35)
  Top 0.254: v24.42,6.81 24.42,6.71 26.28,4.85 R6.2 | v24.34,16.83 24.34,16.93 24.16,17.11 U3.40
  Bottom 0.254: v24.42,6.81 24.42,16.83 v24.34,16.83
LED2  (via drill 0.35)
  Top 0.254: R7.2 33.13,5.71 26.27,5.71 25.3,6.68 v25.3,6.85 | v25.27,17.38 25.05,17.38 24.82,17.62 U3.39
  Bottom 0.254: v25.27,17.38 25.27,6.87 v25.3,6.85
LED3  (via drill 0.35)
  Top 0.254: v26.14,6.86 26.16,6.86 26.8,6.22 37.63,6.22 R8.2 | v26.01,17.98 25.87,18.13 18.97,18.13 U3.38
  Bottom 0.254: v26.14,6.86 26.14,17.86 v26.01,17.98
LED4  (via drill 0.35)
  Top 0.254: R9.2 40.07,6.78 27.2,6.78 v27.07,6.9 | v26.59,18.59 18.96,18.59 U3.37
  Bottom 0.254: v27.07,6.9 27.07,18.11 v26.59,18.59
LED_WALL_1  (via drill 0.35)
  Top 0.254: U3.36 22.03,19.11 v23.5,20.58 | R14.2 45.92,49.37 45.31,48.76 v37.9,48.76
  Bottom 0.254: v37.9,48.77 v37.9,48.76 30.52,48.76 29.7,47.95 29.7,26.79 v23.5,20.58
LED_WALL_2  (via drill 0.35)
  Top 0.254: v22.53,20.6 21.57,19.64 18.98,19.64 U3.35 | v41.2,56.61 41.93,57.34 R18.2
  Bottom 0.254: v22.53,20.6 28.98,27.05 28.98,50.05 35.55,56.61 v41.2,56.61
LED_WALL_3  (via drill 0.35)
  Top 0.254: U3.34 20.56,20.11 20.62,20.05 21.12,20.05 v21.71,20.64 | v23.15,56.8 23.15,57.88 R22.2
  Bottom 0.254: v21.71,20.64 28.34,27.27 28.34,55.41 26.95,56.8 v23.15,56.8
LED_WALL_4  (via drill 0.35)
  Top 0.254: U3.33 20.82,20.61 v20.87,20.66 | v20.17,49.23 19.89,49.23 R26.2
  Bottom 0.254: v20.87,20.66 27.65,27.44 27.65,48.15 26.57,49.23 v20.17,49.23
MD_AIN1  (via drill 0.35)
  Top 0.254: U4.21 42.62,19.41 v42.59,19.38 | v27.78,15.64 25.12,15.64 22.57,13.08 U3.52
  Bottom 0.254: v42.59,19.38 42.59,16.73 41.5,15.64 v27.78,15.64
MD_AIN2  (via drill 0.35)
  Top 0.254: U3.51 22.15,11.07 22.15,13.56 25.05,16.46 v27.77,16.46 | v41.79,19.35 41.97,19.53 U4.22
  Bottom 0.254: v27.77,16.46 41.17,16.46 41.8,17.09 41.8,19.34 v41.79,19.35
MD_BIN1  (via drill 0.35)
  Top 0.254: v27.74,13.99 25.04,13.99 23.57,12.52 U3.54 | v45.03,19.34 45.03,19.66 45.22,19.84 U4.17
  Bottom 0.254: v45.03,19.34 45.04,19.34 45.04,16.42 42.61,13.99 v27.74,13.99
MD_BIN2  (via drill 0.35)
  Top 0.254: U3.55 24.15,11.07 24.15,12.02 25.3,13.17 v27.74,13.17 | v45.87,19.38 U4.16
  Bottom 0.254: v27.74,13.17 43.14,13.17 45.87,15.9 v45.87,19.38
MD_PWMA
  Top 0.254: U3.14 31.96,19.61 34.49,22.15 40.83,22.15 41.32,21.65 U4.23
MD_PWMB  (via drill 0.35)
  Top 0.254: U3.16 32.28,20.61 34.28,22.6 v41.31,22.6 | v46.29,22.21 46.52,21.98 U4.15
  Bottom 0.254: v41.31,22.6 45.9,22.6 v46.29,22.21
MD_STBY  (via drill 0.35)
  Top 0.254: U3.53 23.15,11.07 23.15,12.9 25.07,14.82 v27.77,14.82 | U4.19 43.93,20.68 v43.93,19.41
  Bottom 0.254: v27.77,14.82 42.06,14.82 43.91,16.67 43.91,19.39 v43.93,19.41
MOT_AO1  (via drill 0.6)
  Top 0.406: U4.2 40.98,13.44 U4.1
  Top 1.016: 40.98,13.44 40.98,10.51 42.03,9.46 v42.03,6.51
  Bottom 0.508: J6.2 19.76,3.48 26.12,3.48
  Bottom 1.016: v42.03,6.51 39,3.48 26.12,3.48
MOT_AO2  (via drill 0.6)
  Top 0.406: U4.5 43.59,13.44 U4.6
  Top 1.016: 43.59,13.44 | v43.51,3.85 43.59,3.94 43.59,13.44
  Bottom 0.254: 24.47,0.89 24.28,0.7
  Bottom 0.508: J6.1 18.46,1.58 19.34,0.7 23.63,0.7 | 23.63,0.7 24.04,0.7 24.28,0.7 | 23.63,0.7
  Bottom 1.016: 24.47,0.89 40.55,0.89 v43.51,3.85
MOT_BO1
  Top 0.406: U4.11 47.53,13.44 U4.12
  Top 1.016: 47.53,13.44 47.53,8.79 46.39,7.64 46.39,4.84 J7.2
MOT_BO2
  Top 0.406: U4.7 44.88,13.44 U4.8
  Top 1.016: 44.88,13.44 44.88,2.89 45.54,2.23 J7.1
N$1
  Top 1.016: SW1.3 62.59,6.71 | 62.59,6.71 SW1.6 | 62.59,6.71 65.85,9.97 J1.2
N$2
  Top 0.508: U1.4 52.34,11.95 C2.1
N$3
  Top 0.254: U3.6 34.95,15.61 37.65,12.91 X1.3
N$4
  Top 0.508: U2.4 52.13,21.26 C4.1
N$5
  Top 0.254: X1.1 35.65,14.1 34.64,15.11 U3.5
N$6
  Top 0.254: U3.47 20.01,13.61 20.24,13.38 20.24,11.86 18.43,10.05 18.29,10.05 C8.1
N$7
  Top 0.254: U3.31 21.57,24.18 20.73,25.02 19.88,25.02 C9.1
N$8
  Top 0.508: LED1.C 57.41,20.58 R4.2
N$9  (via drill 0.35, 0.6)
  Top 0.508: SP1.2 38.75,53.59 | R11.1 38.88,53.47 38.75,53.59 | v40.37,43.35 40.37,45 37.16,48.21 37.16,51.81 38.75,53.4 38.75,53.59 | v44.76,30.35 45.89,30.35 46.41,29.83 Q1.3
  Bottom 0.508: v40.37,43.35 40.37,42.41 38.19,40.23 38.19,32.77 40.61,30.35 v44.76,30.35
N$10
  Top 0.254: 45.51,26.71 Q1.1 45.59,26.63 R12.1
N$11
  Top 0.254: R13.2 51.55,47.43 55.24,43.73 64.53,43.73 64.61,43.81 Q2.-
N$12
  Top 0.254: Q3.3 49.92,54.72 51.6,53.04 51.6,52 R13.1
N$13
  Top 0.254: R17.2 38.96,66.88 Q5.-
N$14
  Top 0.254: R14.1 46.37,52.42 Q3.1 47.97,50.64 R15.2
N$15
  Top 0.254: Q6.3 45.44,61.1 R17.1
N$16
  Top 0.254: R18.1 43.02,59.85 43.7,59.17 43.7,58 Q6.1 43.78,57.89 R19.2
N$17
  Top 0.254: R21.2 30.41,62.37 32.56,64.52 Q8.-
N$18
  Top 0.254: Q9.3 25.12,61.23 R21.1
N$19
  Top 0.254: R22.1 24.32,59.7 25.12,58.9 Q9.1 25.31,57.79 R23.2
N$20
  Top 0.254: R25.2 19.25,45.31 Q11.-
N$21
  Top 0.254: Q12.3 23.23,55.02 24.35,53.89 R25.1
N$22
  Top 0.254: R27.2 20.69,52.64 Q12.1 20,52.11 R26.1
N$24
  Top 0.254: LED2.C 30.9,3.25 R6.1
N$25
  Top 0.254: LED3.C 33.9,3.25 R7.1
N$26
  Top 0.2: U5.10 35.2,24.02 C14.1
N$27
  Top 0.508: U6.4 57.16,15.44 C19.1
N$28
  Top 0.254: LED4.C 38.9,3.25 R8.1
N$29
  Top 0.254: LED5.C 41.9,3.25 R9.1
SEN_WALL_1  (via drill 0.35)
  Top 0.254: v37.09,18.09 36.89,17.89 36.89,17.87 35.62,16.61 U3.8 | v39.16,42.65 65.64,42.65 66.22,43.24 | 66.22,43.24 66.22,43.4 66.22,46.23 65.55,46.91 Q4.- | 66.22,43.24 66.22,40.51 R16.2
  Bottom 0.254: v39.16,42.65 37.09,40.58 v37.09,18.09
SEN_WALL_2  (via drill 0.35)
  Top 0.254: v36.28,18.12 36.08,17.92 36.08,17.89 35.33,17.14 30.72,17.14 U3.9 | v36.2,44.28 36.2,67.3 38.47,69.56 40.53,69.56 Q7.- 43.45,66.69 R20.2
  Bottom 0.254: v36.2,44.28 36.28,44.21 v36.28,18.12
SEN_WALL_3  (via drill 0.35)
  Top 0.254: U3.10 30.75,17.55 34.92,17.55 35.27,17.9 35.27,17.94 v35.47,18.14 | v33.02,44.13 33.02,67.91 34.27,69.16 34.27,71.09 32.76,72.59 31.93,72.59 | R24.2 26.76,70.09 23.1,73.74 23.1,74.53 23.32,74.75 23.37,74.75 24.34,76.05 24.34,76.21 24.56,76.44 25.39,76.44 25.61,76.21 25.61,75.86 29.32,73.08 29.87,73.08 30.1,72.86 30.1,72.49 Q10.- 31.93,72.59 | 31.93,72.59
  Bottom 0.254: v33.02,44.13 35.47,41.68 v35.47,18.14
SEN_WALL_4  (via drill 0.35)
  Top 0.254: 34.62,18.11 v34.67,18.15 | v32.55,42.59 8.13,42.59 6.63,44.09 | 6.63,44.09 6.63,46.32 Q13.- | 6.63,44.09 4.45,41.91 R28.2
  Top 0.305: U3.11 34.62,18.11
  Bottom 0.254: v34.67,18.15 34.67,40.46 34.67,40.47 v32.55,42.59
SWCLK
  Top 0.254: U3.49 20.79,10.99 18.4,8.6 13.05,8.6 J3.1
SWDIO
  Top 0.254: J3.2 16.02,14.11 U3.46
SWITCH2  (via drill 0.35)
  Top 0.254: v50.56,59.92 53.03,59.92 SW3.4 57.81,59.8 | v29.64,8.4 29.52,8.29 27.8,8.29 27.07,9.01 U3.61 | 57.81,59.8 SW3.3 | R10.1 57.81,61.28 57.81,59.8
  Bottom 0.254: v50.56,59.92 48.22,59.92 41.5,53.21 41.5,41.83 39.42,39.75 39.42,33.16 40.51,32.08 46.11,32.08 49.02,29.16 49.02,22.74 47.6,21.31 47.6,15.06 43.75,11.21 32.44,11.21 v29.64,8.4
USART_RX
  Top 0.254: U3.43 10.83,15.61 10.61,15.61 8.89,15.61 6.63,13.35 6.63,9.29 J2.1
USART_TX
  Top 0.254: U3.42 8.57,16.11 5.85,13.39 5.85,11.05 J2.2
V+  (via drill 0.35, 0.6)
  Top 0.406: U4.14 47.17,17.89 | U4.13 47.82,17.94 47.87,17.89
  Top 0.508: C20.1 61.5,12.33 U6.1 59.74,12.31 58.95,12.31 58.65,12.61 58.65,13.95 58.93,14.23 U6.3 | U4.24 40.67,17.91 40.65,17.89 | R2.2 52.03,30.78 R1.2
  Top 0.813: R1.2 57,30.81 v58.03,29.78 | R11.2 40.88,50.27 40.86,50.25
  Top 1.016: SW1.5 v60.09,4.76 SW1.2 61.99,11.02 C20.1 | C17.1 39.29,17.89 40.65,17.89 47.17,17.89 47.87,17.89 C13.1 49.2,19.73 v49.23,19.75
  Top 1.27: SP1.1 40.86,50.25 43.73,50.25 v43.84,50.14
  Bottom 1.016: v49.23,19.75 55.21,19.75 58.55,16.42 67.85,16.42 68.92,15.35 68.92,6.78 66.89,4.76 v60.09,4.76
  Bottom 1.27: v43.84,50.14 53.25,50.14 58.03,45.36 v58.03,29.78 58.03,17.1 58.55,16.58 58.55,16.42
VCC  (via drill 0.35)
  Top 0.254: C7.1 17.77,11.94 U3.48 18.88,13.04 v17.27,13.04 | C6.1 31.2,10.39 | 32.05,10.39 33.01,10.39 C5.1 33.2,10.56 33.2,12.45 32.54,13.11 U3.1 | 32.05,10.39 31.2,10.39 | U3.64 29.16,10.39 31.2,10.39 | C11.1 32.23,24.2 31.75,24.67 28.25,24.67 27.57,23.99 U3.19 27.58,22.71 27.58,21.58 27.2,21.19 | C10.1 20.13,23.66 U3.32 | U4.20 43.27,22.66 C16.1 42.56,23.37 v41.77,23.37 | SW2.1 SW2.2 16.85,50.83 19.06,48.62 19.93,48.62 v20.17,48.38 | v19.97,26.46 19.44,26.46 18.83,25.85 18.83,24.59 C10.1 | SW3.2 SW3.1 53.12,58.23 v51.56,58.23 | v42.67,1.56 42.48,1.75 LED5.A LED4.A LED3.A LED2.A 29.41,1.66 26,1.66 25.28,2.38 v25.28,4.26 | v52.58,7.11 52.41,7.29 52.41,8.62 | v32.09,9.46 32.05,9.5 32.05,10.39 | C10.1 19.77,23.64 19.77,22.21 18.91,21.35 | v17.24,20.74 17.84,21.35 18.91,21.35 | 27.2,21.19 22.8,21.19 22.72,21.26 19,21.26 18.91,21.35 | 27.2,21.19 27.53,21.19 29.61,19.11 U3.13 33.01,19.11 C12.1 33.47,20.3 34.71,21.54 v37.92,21.54 | C1.1 50.83,8.57 v48.96,10.44 | v56.11,22.06 56.18,22.12 LED1.A
  Top 0.508: U1.5 52.41,8.62 C1.1
  Bottom 0.254: v42.67,1.56 43.58,0.66 52.9,0.66 53.46,1.22 53.46,6.24 v52.58,7.11 | v19.97,26.46 25.58,26.46 27.01,27.89 27.01,47.4 25.94,48.46 20.26,48.46 v20.17,48.38 | v32.09,9.46 31.56,9.46 28.39,6.3 27.31,6.3 v25.28,4.26 25.28,5.03 v17.27,13.04 | J3.4 15.88,14.42 v17.27,13.04 | v17.24,20.74 17.24,13.07 v17.27,13.04 | v37.92,21.54 39.75,23.37 v41.77,23.37 | v48.96,10.44 48.96,18.9 48.44,19.43 48.44,21.28 49.87,22.71 | 49.87,22.71 49.96,22.8 55.38,22.8 v56.11,22.06 | 49.87,22.71 49.87,29.29 46.41,32.74 41.25,32.74 40.19,33.8 40.19,39.16 42.15,41.12 42.15,53.28 47.1,58.23 v51.56,58.23

### Text on the board
Document: Faulhaber1717 | 9T m0..5Pinion | 9T m0..5Pinion | 42T m0.5SpurGear | Faulhaber1717 | LiPo | 42T m0.5SpurGear | LiPo
tDocu: BOOT0/SW_L | SW_R | MPU9250/6500 | + | + | TB6612FNG | 5V | 3.3V | STM32F405RGT6TR | GND | GND | + | TX | SWDIO | 12MHz | RX | SWCLK | ON
bDocu: Trident | K.Richardo | 22/11/05